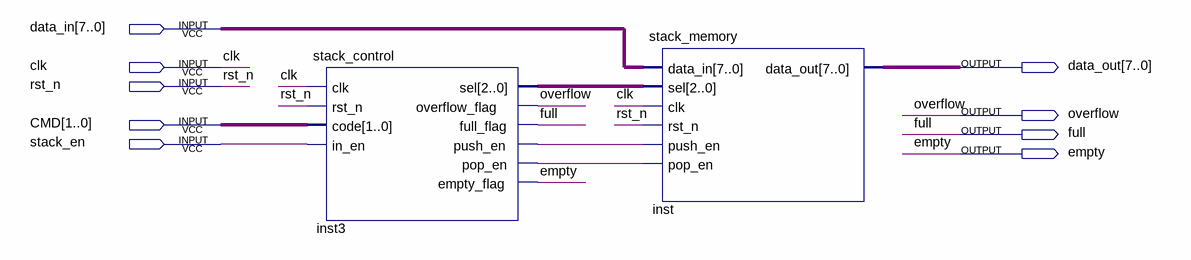
[diagram p0: schematic sheet]
// Quartus schematic stack_unit.bdf as structural Verilog: 2 symbols, 9 pins
module stack_unit (
  input  [7:0] data_in,
  input  clk,
  input  rst_n,
  input  [1:0] CMD,
  input  stack_en,
  output [7:0] data_out,
  output overflow,
  output full,
  output empty
);

  wire inst3_pop_en, inst3_push_en;
  wire [2:0] inst3_sel;

  stack_control inst3 (
    .clk(clk), .rst_n(rst_n), .code(CMD), .in_en(stack_en), .sel(inst3_sel), .overflow_flag(overflow),
    .full_flag(full), .push_en(inst3_push_en), .pop_en(inst3_pop_en), .empty_flag(empty));
  stack_memory inst (
    .data_in(data_in), .sel(inst3_sel), .clk(clk), .rst_n(rst_n), .push_en(inst3_push_en),
    .pop_en(inst3_pop_en), .data_out(data_out));
endmodule
